# EAGLE design TMotor_Rev0 (EAGLE 9.6.2)

## Sheet 1 of 3: Arduino Nano Sense
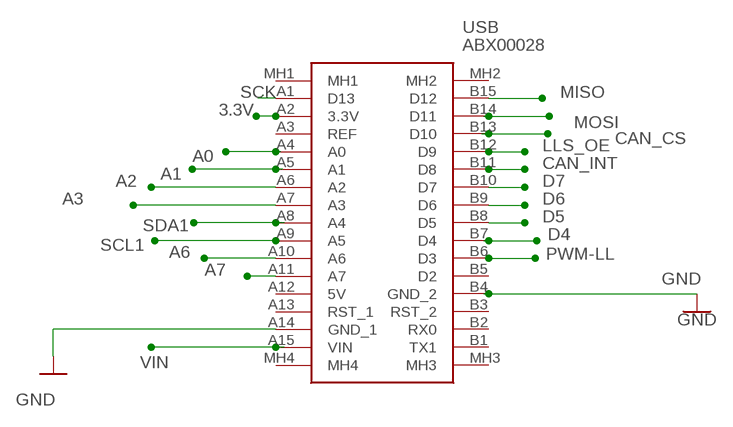
[diagram p0: schematic, sheet 1]

### Parts
USB  ABX00028  [ABX00028]

### Nets
3.3V: USB.A2(3.3V) ; also sheet 2
A0: USB.A4(A0) ; also sheet 2
A1: USB.A5(A1)
A2: USB.A6(A2) ; also sheet 2,3
A3: USB.A7(A3) ; also sheet 2,3
A6: USB.A10(A6) ; also sheet 2
A7: USB.A11(A7)
CAN_CS: USB.B13(D10) ; also sheet 2
CAN_INT: USB.B11(D8) ; also sheet 2
D4: USB.B7(D4)
D5: USB.B8(D5)
D6: USB.B9(D6)
D7: USB.B10(D7)
GND: USB.A14(GND_1) USB.B4(GND_2) ; also sheet 2,3
LLS_OE: USB.B12(D9) ; also sheet 2
MISO: USB.B15(D12) ; also sheet 2
MOSI: USB.B14(D11) ; also sheet 2
PWM-LL: USB.B6(D3)
SCK: USB.A1(D13) ; also sheet 2
SCL1: USB.A9(A5)
SDA1: USB.A8(A4)
VIN: USB.A15(VIN) ; also sheet 2
Unconnected: USB.A3(REF) USB.A12(5V) USB.A13(RST_1) USB.B1(TX1) USB.B2(RX0) USB.B3(RST_2) USB.B5(D2) USB.MH1 USB.MH2 USB.MH3 USB.MH4

## Sheet 2 of 3: Motor Drivers & Power
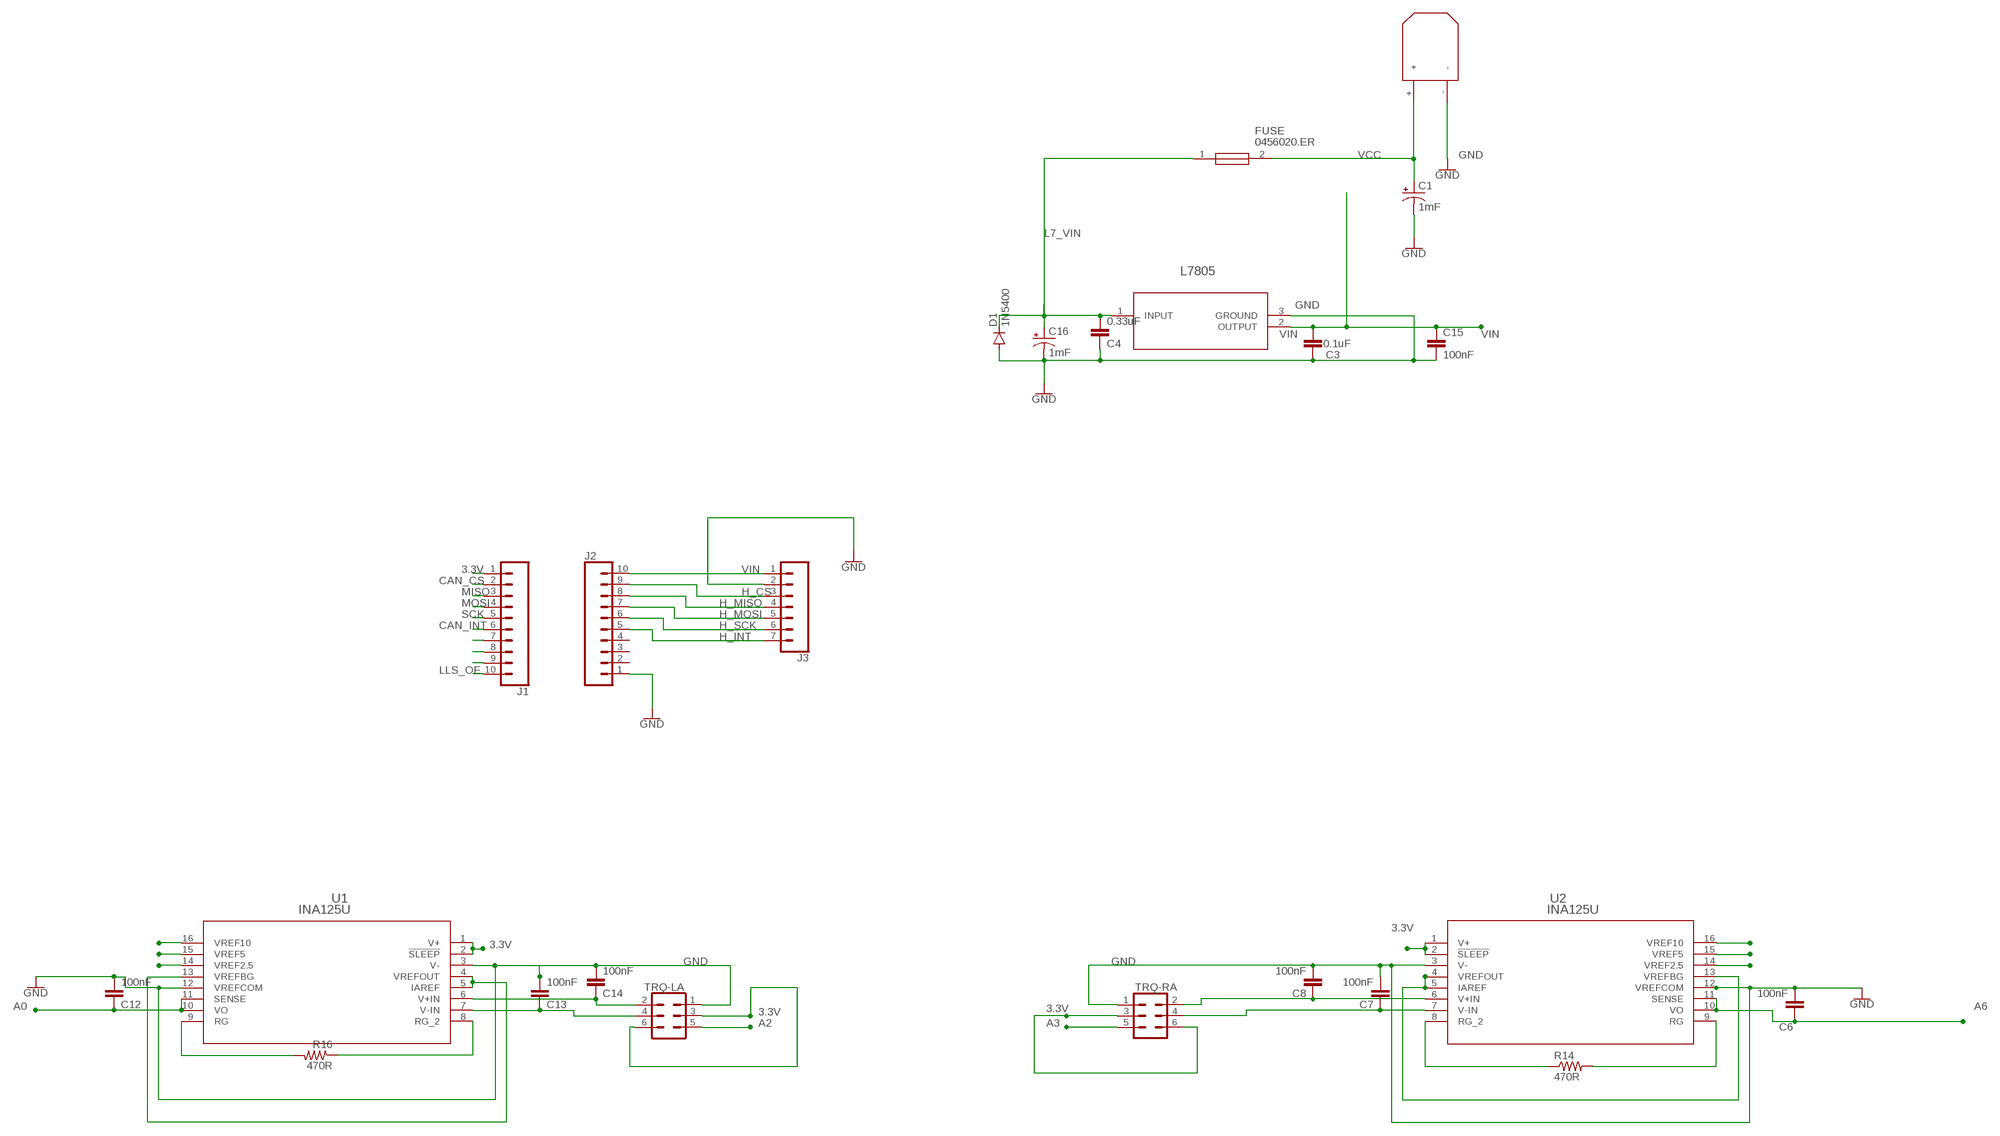
[diagram p1: schematic, sheet 2]

### Parts
C1  1mF  CPOL-USE5-10.5  [E5-10,5]
C3  0.1uF  C-EU050-024X044  [C050-024X044]
C4  0.33uF  C-EU050-024X044  [C050-024X044]
C6  100nF  C-EU050-024X044  [C050-024X044]
C7  100nF  C-EU050-024X044  [C050-024X044]
C8  100nF  C-EU050-024X044  [C050-024X044]
C12  100nF  C-EU050-024X044  [C050-024X044]
C13  100nF  C-EU050-024X044  [C050-024X044]
C14  100nF  C-EU050-024X044  [C050-024X044]
C15  100nF  C-EU050-024X044  [C050-024X044]
C16  1mF  CPOL-USE5-10.5  [E5-10,5]
D1  1N5400  [DO201-15]
FUSE  0456020.ER  [FUSC10131X312N]
J1  CONN_10"  [1X10]
J2  CONN_10"  [1X10]
J3  CONN_07  [1X07]
L7805  L7805CDT-TR  [DPAK_STM]
R14  470R  R-US_0207/10  [0207/10]
R16  470R  R-US_0207/10  [0207/10]
TRQ-LA  CONN_03X2SHROUD  [2X3-SHROUDED]
TRQ-RA  CONN_03X2SHROUD  [2X3-SHROUDED]
U1  INA125U  [D16]
U2  INA125U  [D16]
U$9  XT30  [XT30_HORIZONTAL]

### Nets
3.3V: J1.1 TRQ-LA.3 TRQ-LA.6 TRQ-RA.3 TRQ-RA.6 U1.1(V+) U1.2(!SLEEP) U2.1(V+) U2.2(!SLEEP) ; also sheet 1
A0: C12.1 U1.10(VO) U1.11(SENSE) ; also sheet 1
A2: TRQ-LA.5 ; also sheet 1,3
A3: TRQ-RA.5 ; also sheet 1,3
A6: C6.1 U2.10(VO) U2.11(SENSE) ; also sheet 1
CAN_CS: J1.2 ; also sheet 1
CAN_INT: J1.6 ; also sheet 1
GND: C1.- C3.1 C4.1 C6.2 C7.2 C8.2 C12.2 C13.2 C14.2 C15.2 C16.- D1.A J2.1 J3.2 L7805.3(GROUND) TRQ-LA.1 TRQ-RA.1 U1.3(V-) U1.12(VREFCOM) U2.3(V-) U2.12(VREFCOM) U$9.- ; also sheet 1,3
H_CS: J2.9 J3.3
H_INT: J2.5 J3.7
H_MISO: J2.8 J3.4
H_MOSI: J2.7 J3.5
H_SCK: J2.6 J3.6
L7_VIN: C4.2 C16.+ D1.C FUSE.1 L7805.1(INPUT)
LLS_OE: J1.10 ; also sheet 1
MISO: J1.3 ; also sheet 1
MOSI: J1.4 ; also sheet 1
N$3: U1.4(VREFOUT) U1.5(IAREF) U1.13(VREFBG)
N$4: U2.16(VREF10)
N$5: U2.4(VREFOUT) U2.5(IAREF) U2.13(VREFBG)
N$6: R14.1 U2.8(RG_2)
N$7: R14.2 U2.9(RG)
N$8: C8.1 TRQ-RA.2 U2.6(V+IN)
N$9: C7.1 TRQ-RA.4 U2.7(V-IN)
N$10: C14.1 TRQ-LA.2 U1.6(V+IN)
N$11: C13.1 TRQ-LA.4 U1.7(V-IN)
N$12: R16.2 U1.9(RG)
N$13: R16.1 U1.8(RG_2)
N$14: U2.15(VREF5)
N$19: U2.14(VREF2.5)
N$20: U1.16(VREF10)
N$21: U1.15(VREF5)
N$22: U1.14(VREF2.5)
N$27: J1.7
N$28: J1.8
N$29: J1.9
SCK: J1.5 ; also sheet 1
VCC: C1.+ FUSE.2 U$9.+
VIN: C3.2 C15.1 J2.10 J3.1 L7805.2(OUTPUT) ; also sheet 1
Unconnected: J2.2 J2.3 J2.4

## Sheet 3 of 3: FSRs, Hall, and Breakout
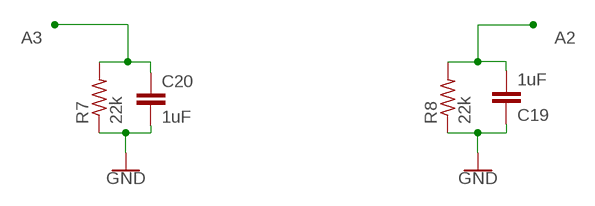
[diagram p2: schematic, sheet 3]

### Parts
C19  1uF  C-EU050-024X044  [C050-024X044]
C20  1uF  C-EU050-024X044  [C050-024X044]
R7  22k  R-US_0207/10  [0207/10]
R8  22k  R-US_0207/10  [0207/10]

### Nets
A2: C19.2 R8.2 ; also sheet 1,2
A3: C20.1 R7.2 ; also sheet 1,2
GND: C19.1 C20.2 R7.1 R8.1 ; also sheet 1,2

## Library data of the parts
C1 C16 = rcl:CPOL-US: POLARIZED CAPACITOR, American symbol; SPICEPREFIX: C
C3 C4 C6-C8 C12-C15 C19 C20 = rcl:C-EU: CAPACITOR, European symbol; SPICEPREFIX: C
D1 = diode:1N5400: DIODE standard rectifier, 3 A, 50 V (Motorola)
FUSE = SamacSys_Parts:0456020.ER: Littelfuse 20A FF Non-Resettable Surface Mount Fuse, 125V ac Source: Datasheet <https://componentsearchengine.com/Datasheets/1/0456020.ER.pdf>; DESCRIPTION: Littelfuse 20A FF Non-Resettable Surface Mount Fuse, 125V ac; HEIGHT: 3.12mm; MANUFACTURER_NAME: LITTELFUSE; MANUFACTURER_PART_NUMBER: 0456020.ER; MOUSER_PART_NUMBER: 576-0456020.ER; MOUSER_PRICE-STOCK: https://www.mouser.com/Search/Refine.aspx?Keyword=576-0456020.ER
J1 J2 = SparkFun-Connectors:CONN_10: Multi connection point. Often used as Generic Header-pin footprint for 0.1 inch spaced/style header connections On any of the 0.1 inch spaced packages, you can populate with these: Break Away Headers - Straight <https://www.sparkfun.com/products/116> (PRT-00116) Break Away Male Headers - Right Angle <https://www.sparkfun.com/products/553> (PRT-00553) Female Headers <https://www.sparkfun.com/products/115> (PRT-00115) Break Away Headers - Machine Pin <https://www.sparkfun.com/products/117> (PRT-00117) Break Away Female Headers - Swiss Machine Pin <https://www.sparkfun.com/products/743> (PRT-00743) Arduino Stackable Header - 10 Pin <https://www.sparkfun.com/products/11376> (PRT-11376) For SCREWTERMINALS and SPRING TERMINALS visit here: Screw Terimnals on SparkFun.com <https://www.sparkfun.com/search/results?term=Screw+Terminals> (5mm/3.5mm/2.54mm spacing) This device is also useful as a general connection point to wire up your design to another part of your project. Our various solder wires solder well into these plated through hole pads. Hook-Up Wire - Assortment (Stranded, 22 AWG) <https://www.sparkfun.com/products/11375> (PRT-11375) Hook-Up Wire - Assortment (Solid Core, 22 AWG) <https://www.sparkfun.com/products/11367> (PRT-11367) View the entire wire category on our website here <https://www.sparkfun.com/categories/141> Special notes: Molex polarized connector foot print use with SKU : PRT-08231 with associated crimp pins and housings. 1MM SMD Version SKU: PRT-10208 NOTES ON THE VARIANTS LOCK and LOCK_LONGPADS... This footprint was designed to help hold the alignment of a through-hole component (i.e. 6-pin header) while soldering it into place. You may notice that each hole has been shifted either up or down by 0.005 of an inch from it's more standard position (which is a perfectly straight line). This slight alteration caused the pins (the squares in the middle) to touch the edges of the holes. Because they are alternating, it causes a "brace" to hold the component in place. 0.005 has proven to be the perfect amount of "off-center" position when using our standard breakaway headers. Although looks a little odd when you look at the bare footprint, once you have a header in there, the alteration is very hard to notice. Also,if you push a header all the way into place, it is covered up entirely on the bottom side.; PROD_ID: CONN-11563
J3 = SparkFun-Connectors:CONN_07: Multi connection point. Often used as Generic Header-pin footprint for 0.1 inch spaced/style header connections On any of the 0.1 inch spaced packages, you can populate with these: Break Away Headers - Straight <https://www.sparkfun.com/products/116> (PRT-00116) Break Away Male Headers - Right Angle <https://www.sparkfun.com/products/553> (PRT-00553) Female Headers <https://www.sparkfun.com/products/115> (PRT-00115) Break Away Headers - Machine Pin <https://www.sparkfun.com/products/117> (PRT-00117) Break Away Female Headers - Swiss Machine Pin <https://www.sparkfun.com/products/743> (PRT-00743) For SCREWTERMINALS and SPRING TERMINALS visit here: Screw Terimnals on SparkFun.com <https://www.sparkfun.com/search/results?term=Screw+Terminals> (5mm/3.5mm/2.54mm spacing) This device is also useful as a general connection point to wire up your design to another part of your project. Our various solder wires solder well into these plated through hole pads. Hook-Up Wire - Assortment (Stranded, 22 AWG) <https://www.sparkfun.com/products/11375> (PRT-11375) Hook-Up Wire - Assortment (Solid Core, 22 AWG) <https://www.sparkfun.com/products/11367> (PRT-11367) View the entire wire category on our website here <https://www.sparkfun.com/categories/141> Special notes: Molex polarized connector foot print use with SKU : PRT-08231 with associated crimp pins and housings. 1MM SMD Version SKU: PRT-10208 NOTES ON THE VARIANTS LOCK and LOCK_LONGPADS... This footprint was designed to help hold the alignment of a through-hole component (i.e. 6-pin header) while soldering it into place. You may notice that each hole has been shifted either up or down by 0.005 of an inch from it's more standard position (which is a perfectly straight line). This slight alteration caused the pins (the squares in the middle) to touch the edges of the holes. Because they are alternating, it causes a "brace" to hold the component in place. 0.005 has proven to be the perfect amount of "off-center" position when using our standard breakaway headers. Although looks a little odd when you look at the bare footprint, once you have a header in there, the alteration is very hard to notice. Also,if you push a header all the way into place, it is covered up entirely on the bottom side.
L7805 = 7805Regulator:L7805CDT-TR; BUILT_BY: EMA_UL_Team; MANUFACTURER_PART_NUMBER: L7805CDT-TR; SOURCELIBRARY: StMicro_2011-06-07; VENDOR: STMicroelectronics
R7 R8 = resistor:R-US_: RESISTOR, American symbol
R14 R16 = rcl:R-US_: RESISTOR, American symbol; SPICEPREFIX: R
TRQ-LA TRQ-RA = SparkFun-Connectors:CONN_03X2: Multi connection point. Often used as Generic Header-pin footprint for 0.1 inch spaced/style header connections You can populate with any combo of single row headers, but if you'd like an exact match, check these: Header - 2x3 (Male, 0.1") <https://www.sparkfun.com/products/12807> (PRT-12807) Header - 2x3 (Female, 0.1") <https://www.sparkfun.com/products/13010> (PRT-13010) 2x3 Pin Shrouded Header <https://www.sparkfun.com/products/10877> (PRT-10877) On any of the 0.1 inch spaced packages, you can populate with these: Break Away Headers - Straight <https://www.sparkfun.com/products/116> (PRT-00116) Break Away Male Headers - Right Angle <https://www.sparkfun.com/products/553> (PRT-00553) Female Headers <https://www.sparkfun.com/products/115> (PRT-00115) Break Away Headers - Machine Pin <https://www.sparkfun.com/products/117> (PRT-00117) Break Away Female Headers - Swiss Machine Pin <https://www.sparkfun.com/products/743> (PRT-00743) Special note: the shrouded connector mates well with our 3x2 ribbon cables: Ribbon Crimp Connector - 6-pin (2x3, Female) <https://www.sparkfun.com/products/10651> (PRT-10651) Ribbon Cable - 6 wire (15ft) <https://www.sparkfun.com/products/10646> (PRT-10646); PROD_ID: CONN-10681; SF_ID: PRT_10877
U1 U2 = Digikey:INA125U; DATASHEET_URL: http://www.ti.com/lit/gpn/INA125; DESCRIPTION: Instrumentation Amplifier with Precision Voltage Reference; FAMILY_NAME: SINGLE SUPPLY; GENERIC_PART_NUMBER: INA125; INDUSTRY_STD_PKG_TYPE: SOIC; MANUFACTURER: Texas Instruments; MANUFACTURER_PART_NUMBER: INA125U; PACKAGE_DESIGNATOR: D; PIN_COUNT: 16; VENDOR: Texas Instruments
U$9 = Ben_Library:XT30
USB = ABX00028:ABX00028: Development Boards & Kits - AVR Arduino Nano Every Source: Datasheet <https://store.arduino.cc/arduino-nano-every>; ARROW_PART_NUMBER: ABX00028; ARROW_PRICE-STOCK: https://www.arrow.com/en/products/abx00028/arduino-corporation; DESCRIPTION: Development Boards & Kits - AVR Arduino Nano Every; HEIGHT: 10mm; MANUFACTURER_NAME: Arduino; MANUFACTURER_PART_NUMBER: ABX00028; MOUSER_PART_NUMBER: 782-ABX00028; MOUSER_PRICE-STOCK: https://www.mouser.co.uk/ProductDetail/Arduino/ABX00028/?qs=PzGy0jfpSMtit6rnFl8mVg%3D%3D

## Board
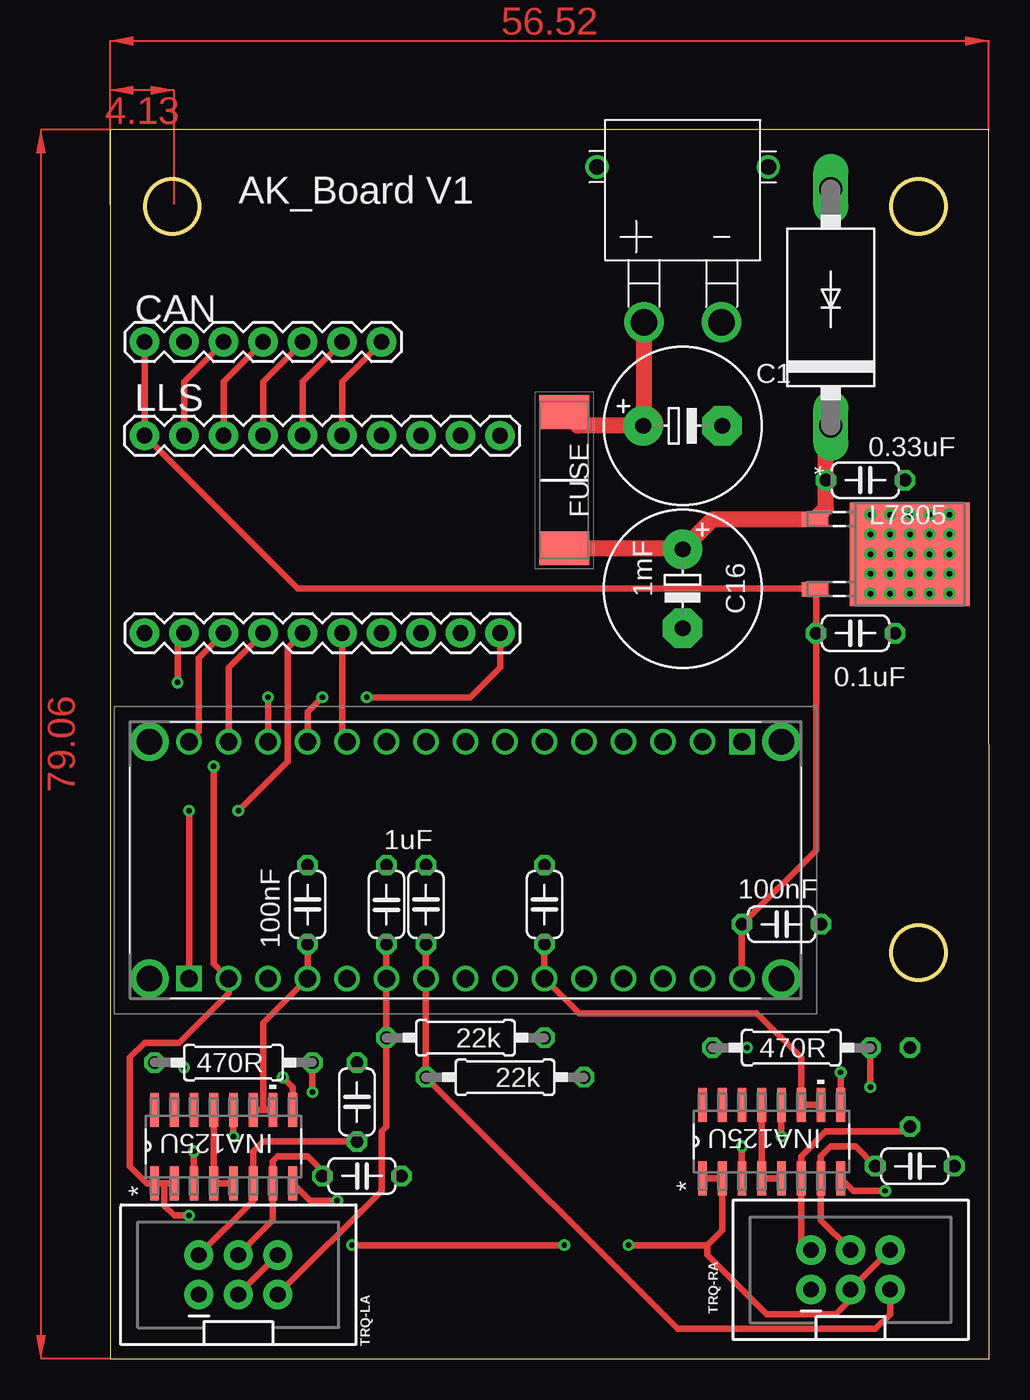
[diagram p3: board, top side]
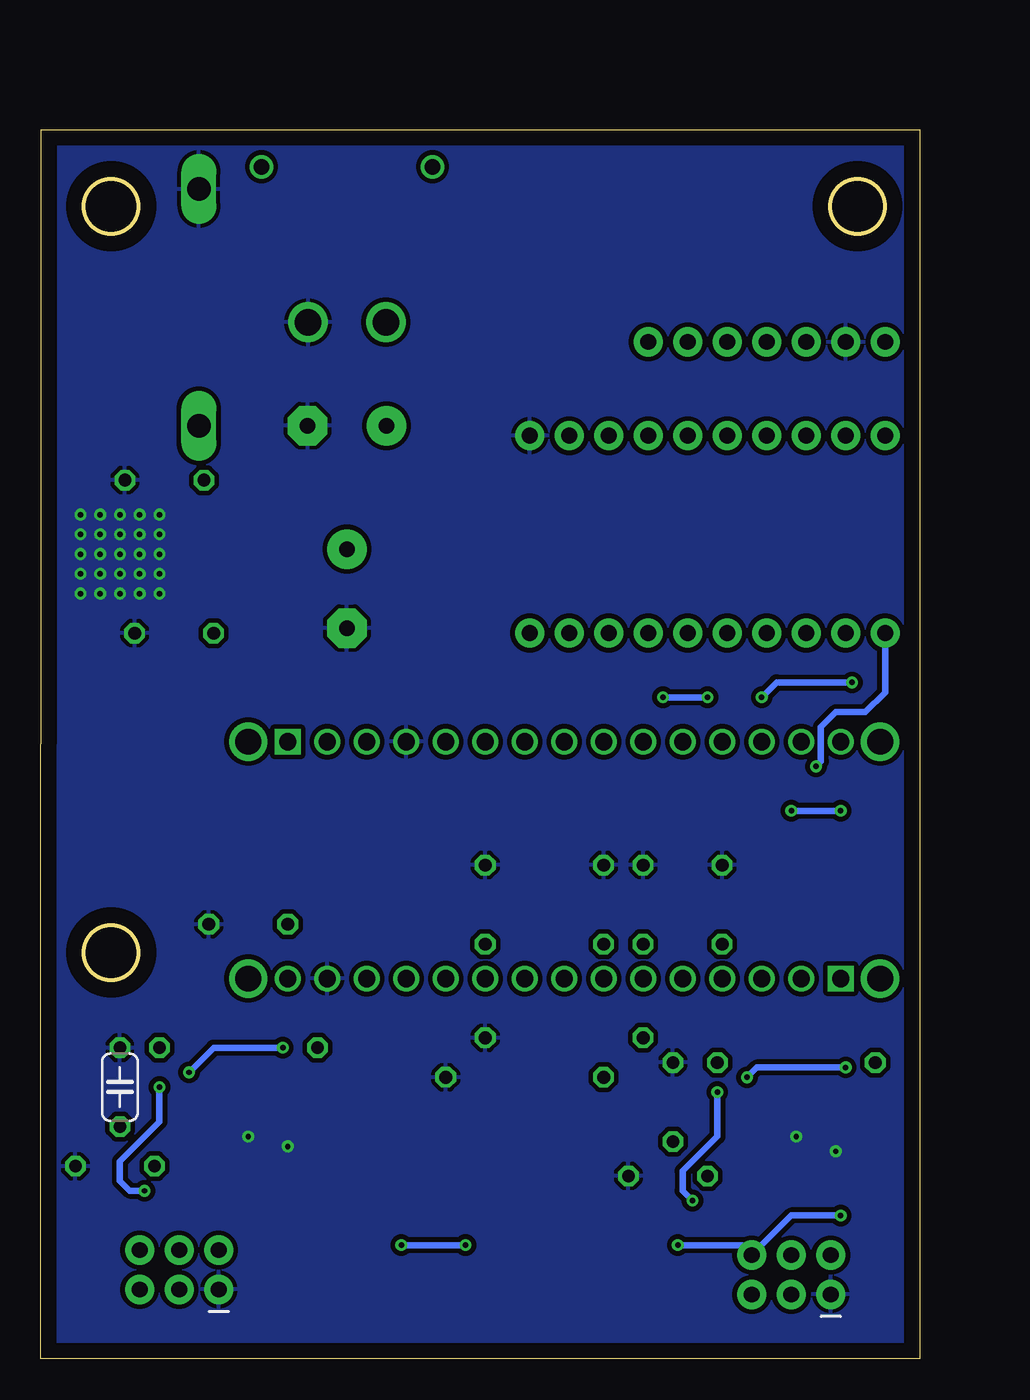
[diagram p4: board, bottom side, seen from below]

Size 56.53 x 79.05 mm. Coordinates in mm from the lower left corner, seen from the top.
Outline: 0,0 56.53,0 56.49,79.05 0,79.05 0,0
Outline: circle at 4,74.13 radius 1.75
Outline: circle at 52,74.13 radius 1.75
Outline: circle at 52,26.13 radius 1.75
Copper layers (1*16): Top 0.035mm / dielectric 0.15mm / Bottom 0.035mm
Design rules "default": minimum track width 6mil, minimum drill 0.35mm, track to track 6mil, track to pad 6mil, pad to pad 6mil, via to via 6mil, smd to smd 6mil, copper to edge 40mil, drill to drill 6mil, minimum pad ring 10mil, minimum via ring 8mil, stop-mask expansion 4mil, vias tented up to drill 0mil, thermal gap 10mil

### Footprints (pad centres in the part's own frame; a part is rotated, then mirrored left to right if it is on the bottom)
E5-10,5 = drill 1.016 pad 2.54: + -2.54,0 | drill 1.016 pad 2.54 octagon: - 2.54,0
C050-024X044 = drill 0.813 octagon: 1 -2.54,0; 2 2.54,0
DO201-15 = drill 1.499 long: A 7.62,0; C -7.62,0
FUSC10131X312N = smd 2.16 x 3.23: 1 -4.375,0; 2 4.375,0
1X10 = drill 1.016 pad 1.88: 1 0,0; 2 2.54,0; 3 5.08,0; 4 7.62,0; 5 10.16,0; 6 12.7,0; 7 15.24,0; 8 17.78,0; 9 20.32,0; 10 22.86,0
1X07 = drill 1.016 pad 1.88: 1 0,0; 2 2.54,0; 3 5.08,0; 4 7.62,0; 5 10.16,0; 6 12.7,0; 7 15.24,0
DPAK_STM = smd 0.94 x 1.702: 1 -2.25,-6.109; 2 2.25,-6.109 | smd 6.655 x 7.722: 3 0,0
0207/10 = drill 0.813 octagon: 1 -5.08,0; 2 5.08,0
2X3-SHROUDED = drill 1.016 pad 1.88: 1 -1.27,2.54; 2 1.27,2.54; 3 -1.27,0; 4 1.27,0; 5 -1.27,-2.54; 6 1.27,-2.54
D16 = smd 2.184 x 0.559: 1 -2.362,4.445; 2 -2.362,3.175; 3 -2.362,1.905; 4 -2.362,0.635; 5 -2.362,-0.635; 6 -2.362,-1.905; 7 -2.362,-3.175; 8 -2.362,-4.445; 9 2.362,-4.445; 10 2.362,-3.175; 11 2.362,-1.905; 12 2.362,-0.635; 13 2.362,0.635; 14 2.362,1.905; 15 2.362,3.175; 16 2.362,4.445
XT30_HORIZONTAL = drill 1.7: + -2.5,0; - 2.5,0 | drill 1: P$3 5.5,10; P$4 -5.5,10
ABX00028 = drill 1.11 pad 1.665 square: A1 0,0; B1 35.56,15.24 | drill 1.11 pad 1.665: A2 2.54,0; A3 5.08,0; A4 7.62,0; A5 10.16,0; A6 12.7,0; A7 15.24,0; A8 17.78,0; A9 20.32,0; A10 22.86,0; A11 25.4,0; A12 27.94,0; A13 30.48,0; A14 33.02,0; A15 35.56,0; B2 33.02,15.24; B3 30.48,15.24; B4 27.94,15.24; B5 25.4,15.24; B6 22.86,15.24; B7 20.32,15.24; B8 17.78,15.24; B9 15.24,15.24; B10 12.7,15.24; B11 10.16,15.24; B12 7.62,15.24; B13 5.08,15.24; B14 2.54,15.24; B15 0,15.24 | drill 1.65 pad 2.475: MH1 -2.54,0; MH2 -2.54,15.24; MH3 38.1,15.24; MH4 38.1,0

### Placement (x,y rotation side)
C1  36.83,60.01 0 top
C3  47.94,46.67 180 top
C4  48.58,56.52 180 top
C6  27.94,29.21 90 top
C7  51.75,12.38 0 top
C8  51.44,17.46 90 bottom
C12  12.7,29.21 90 top
C13  16.19,11.75 0 top
C14  15.88,16.51 90 top
C15  43.18,27.94 0 top
C16  36.83,49.53 270 top
C19  17.78,29.21 270 top
C20  20.32,29.21 90 top
D1  46.35,67.63 90 top
FUSE  29.21,56.52 90 top
J1  2.22,46.67 0 top
J2  25.08,59.37 180 top
J3  2.22,65.41 0 top
L7805  51.44,51.75 270 top
R7  25.4,18.1 180 top
R8  22.86,20.64 180 top
R14  43.81,20 180 top
R16  7.94,19.05 180 top
TRQ-LA  8.26,5.4 90 top
TRQ-RA  47.62,5.71 90 top
U1  7.3,13.65 90 top
U2  42.55,13.97 90 top
U$9  36.83,66.67 0 top
USB  5.08,24.45 0 top

### Tracks (layer width: path | path; a pad name or v marks a point on that pad's centre or on a via)
3.3V  (via drill 0.35)
  Top 0.406: 3.49,11.29 U1.1 2.36,11.29 1.27,12.38 1.27,19.37 2.22,20.32 4.45,20.32 7.62,23.49 USB.A2 6.67,25.4 v6.67,38.1 | U1.2 3.49,11.29 | TRQ-RA.6 TRQ-RA.3 47.62,3.81 46.67,2.86 42.23,2.86 38.42,6.67 38.42,7.3 | TRQ-LA.6 TRQ-LA.3 | U2.1 U2.2 39.37,8.26 38.42,7.3 | 3.49,11.29 3.49,9.84 4.13,9.21 v5.08,9.21 | v15.56,7.3 v29.21,7.3 | v33.34,7.3 38.42,7.3
  Bottom 0.406: v6.67,38.1 6.35,38.42 6.35,40.64 5.4,41.59 3.49,41.59 2.22,42.86 J1.1 | v5.08,9.21 8.26,9.21 TRQ-LA.6 11.43,7.3 v15.56,7.3 | v29.21,7.3 v33.34,7.3
A0
  Top 0.406: U1.11 9.84,16.01 | 9.84,16.01 U1.10 | 9.84,16.01 9.84,21.59 USB.A4 C12.1
A2
  Top 0.406: C19.2 USB.A6 R8.2 17.78,14.92 17.46,14.6 17.46,10.8 TRQ-LA.5
A3
  Top 0.406: C20.1 USB.A7 R7.2 36.51,1.9 49.21,1.9 50.16,2.86 TRQ-RA.5
A6
  Top 0.406: U2.10 U2.11 44.45,19.37 41.59,22.23 30.16,22.23 USB.A10 C6.1
CAN_CS  (via drill 0.35)
  Top 0.406: USB.B13 v10.16,42.54 | v4.35,43.5 4.35,46.26 J1.2
  Bottom 0.406: v10.16,42.54 9.21,43.5 v4.35,43.5
CAN_INT
  Top 0.406: J1.6 14.92,40 USB.B11
GND  (via drill 0.35)
  Top 0.406: U1.3 v5.4,13.33 | U1.12 v7.94,14.29 | U2.12 v43.18,14.29 | v40.64,13.65 U2.3
  Top 2.54: L7805.3 51.12,51.43
  other vias: 51.44,51.75 48.9,54.29 50.16,54.29 51.44,54.29 52.7,54.29 53.98,54.29 48.9,53.02 50.16,53.02 51.44,53.02 52.7,53.02 53.98,53.02 48.9,51.75 50.16,51.75 52.7,51.75 53.98,51.75 48.9,50.48 50.16,50.48 51.44,50.48 52.7,50.48 53.98,50.48 48.9,49.21 50.16,49.21 51.44,49.21 52.7,49.21 53.98,49.21
  pour Bottom (isolate 0.305): -1.91,-1.9 59.05,-1.9 59.05,81.6 -1.91,81.6
H_CS
  Top 0.406: J2.9 4.76,62.86 J3.3
H_INT
  Top 0.406: J2.5 14.92,62.86 J3.7
H_MISO
  Top 0.406: J2.8 7.3,62.86 J3.4
H_MOSI
  Top 0.406: J2.7 9.84,62.86 J3.5
H_SCK
  Top 0.406: J2.6 12.38,62.86 J3.6
L7_VIN
  Top 1.016: FUSE.1 36.76,52.14 C16.+ 38.76,54 L7805.1 46.04,54.71 C4.2 46.04,59.69 D1.C
LLS_OE  (via drill 0.35)
  Top 0.406: USB.B12 12.7,41.59 v13.65,42.54 | v16.51,42.54 23.18,42.54 25.08,44.45 J1.10
  Bottom 0.406: v13.65,42.54 v16.51,42.54
MISO
  Top 0.406: USB.B15 5.71,40.32 5.71,45.09 J1.3
MOSI
  Top 0.406: USB.B14 7.62,44.45 J1.4
N$3
  Top 0.406: U1.5 U1.4 U1.13
N$5
  Top 0.406: U2.5 U2.4 U2.13
N$6  (via drill 0.35)
  Top 0.406: R14.1 v48.9,17.46 | v49.85,10.8 47.8,10.8 U2.8
  Bottom 0.406: v48.9,17.46 48.9,15.24 51.44,12.7 51.44,11.43 50.8,10.8 v49.85,10.8
N$7  (via drill 0.35)
  Top 0.406: v40.96,20 R14.2 | v46.99,18.41 U2.9
  Bottom 0.406: v40.96,20 45.4,20 v46.99,18.41
N$8
  Top 0.406: TRQ-RA.2 44.45,7.62 U2.6 44.45,13.02 46.04,14.6 51.12,14.6 C8.1
N$9
  Top 0.406: TRQ-RA.4 45.72,8.89 U2.7 45.72,13.02 46.35,13.65 47.94,13.65 C7.1
N$10
  Top 0.406: TRQ-LA.2 9.21,10.16 U1.6 9.21,13.33 9.84,13.97 C14.1
N$11
  Top 0.406: TRQ-LA.4 10.48,8.89 U1.7 10.48,12.7 10.79,13.02 12.7,13.02 13.65,12.07 C13.1
N$12  (via drill 0.35)
  Top 0.406: R16.2 4.45,19.05 v4.76,18.73 | v11.11,18.1 11.75,17.46 U1.9
  Bottom 0.406: v4.76,18.73 10.48,18.73 v11.11,18.1
N$13  (via drill 0.35)
  Top 0.406: R16.1 v13.02,17.15 | v14.61,10.16 12.88,10.16 U1.8
  Bottom 0.406: v13.02,17.15 13.02,14.29 15.24,12.07 15.24,10.8 v14.61,10.16
SCK  (via drill 0.35)
  Top 0.406: USB.A1 v5.08,35.24 | v8.26,35.24 11.43,38.42 11.43,45.72 J1.5
  Bottom 0.406: v5.08,35.24 v8.26,35.24
VCC
  Top 1.016: U$9.+ 34.33,60.05 | C1.+ 30.09,60.01 FUSE.2
  Top 2.54: 34.33,60.05 C1.+
VIN
  Top 0.406: USB.A15 C15.1 45.4,32.7 C3.2 45.4,49.43 L7805.2 45.3,49.53 12.06,49.53 J2.10 J3.1
(copper drawn outside any net)
  shapes: Top area x3

### Text on the board
tPlace: AK_Board V1 | CAN | LLS